# EAGLE design Motherboard (EAGLE 8.0.0)
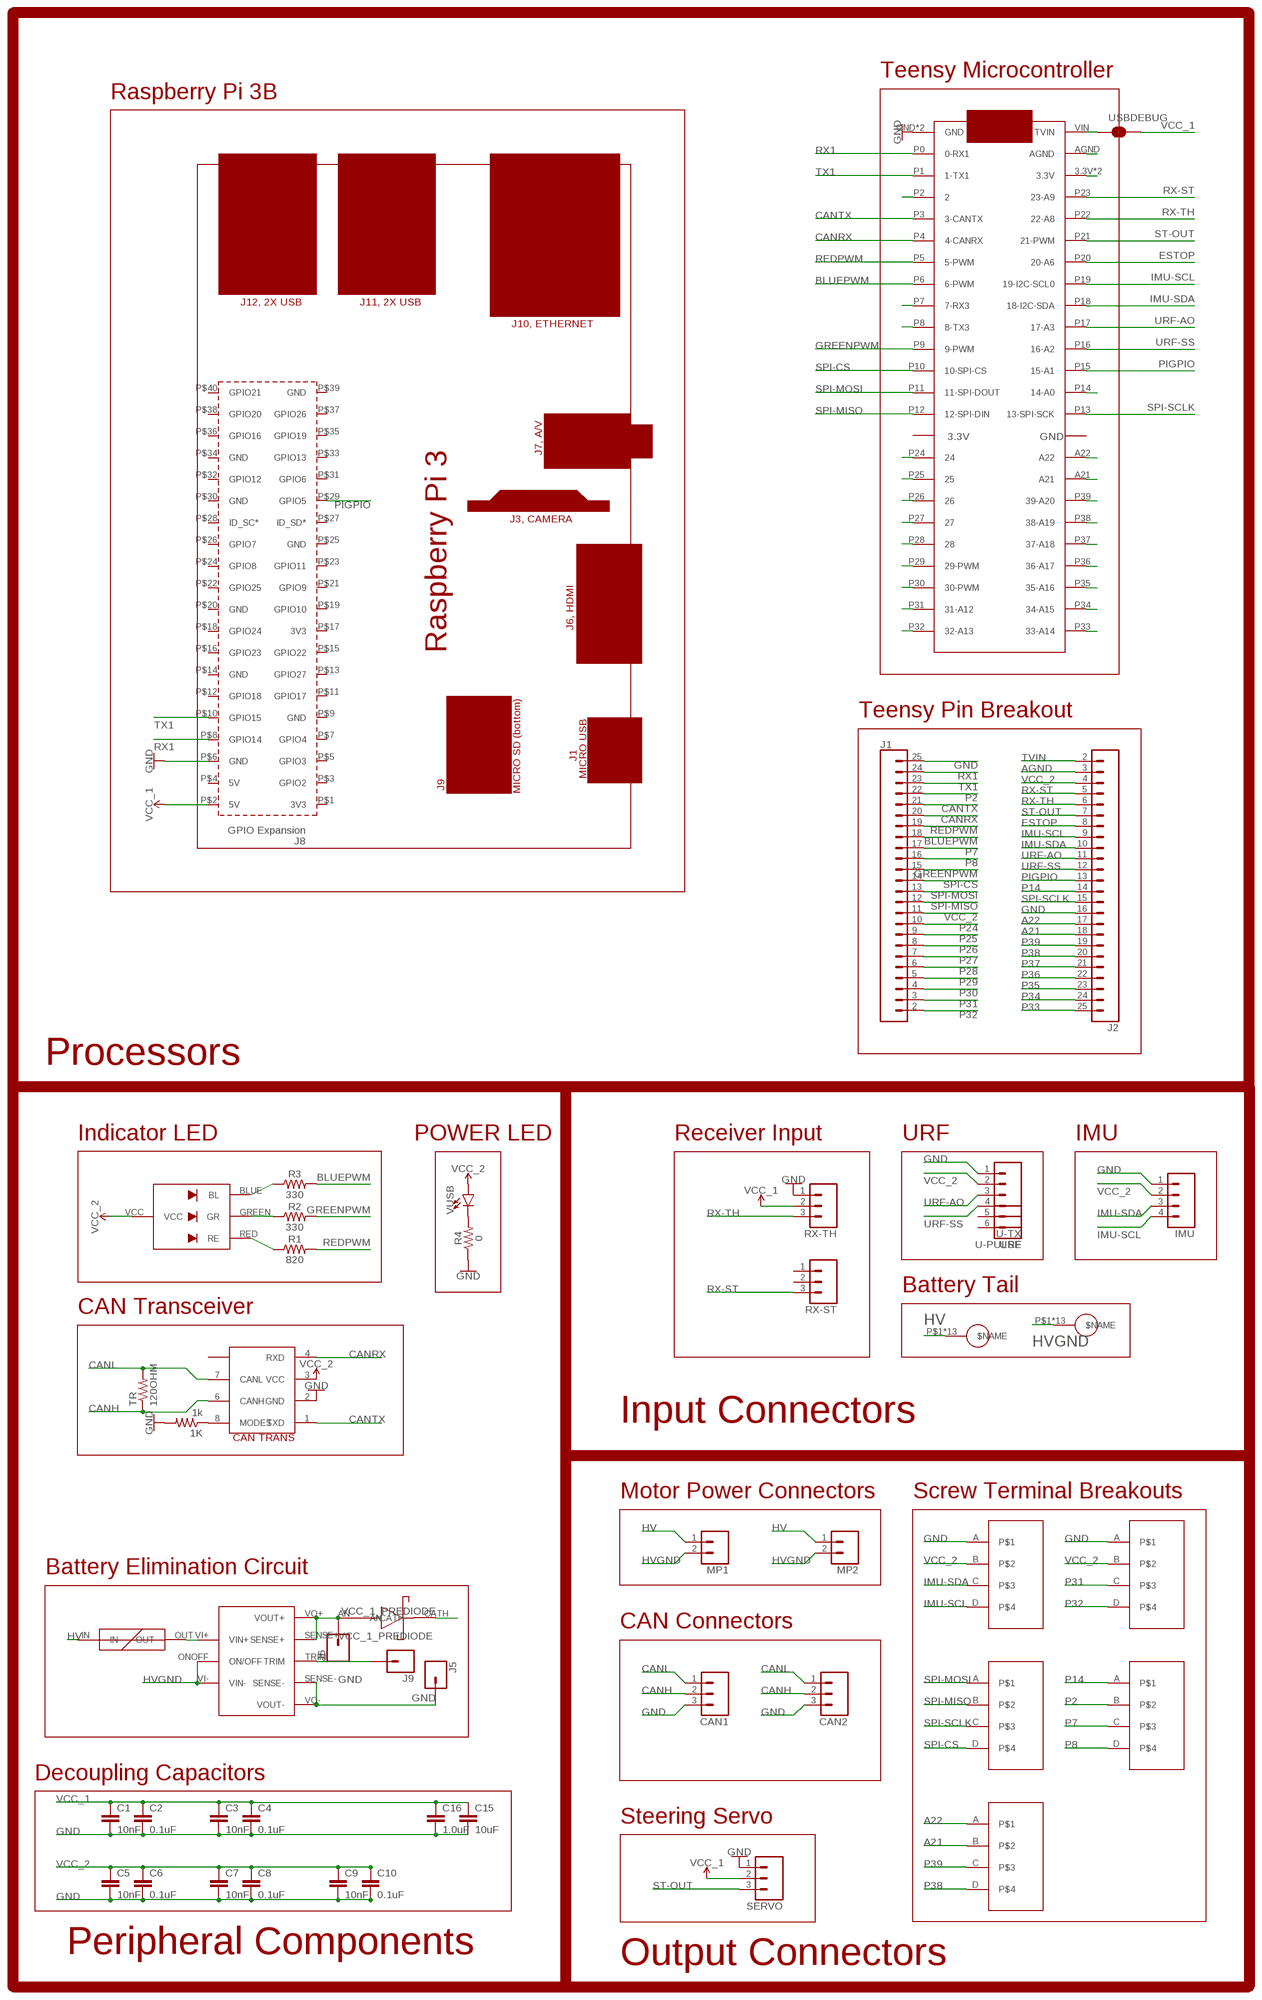
[diagram p0: schematic, sheet 1]

## Parts
1K  1k  R-US_R0603  [R0603]
C1  10nF  10NF-0603-50V-10%  [0603]
C2  0.1uF  0.1UF-0603-25V-(+80/-20%)  [0603]
C3  10nF  10NF-0603-50V-10%  [0603]
C4  0.1uF  0.1UF-0603-25V-(+80/-20%)  [0603]
C5  10nF  10NF-0603-50V-10%  [0603]
C6  0.1uF  0.1UF-0603-25V-(+80/-20%)  [0603]
C7  10nF  10NF-0603-50V-10%  [0603]
C8  0.1uF  0.1UF-0603-25V-(+80/-20%)  [0603]
C9  10nF  10NF-0603-50V-10%  [0603]
C10  0.1uF  0.1UF-0603-25V-(+80/-20%)  [0603]
C15  10uF  10UF-1206-6.3V-20%  [1206]
C16  1.0uF  1.0UF-1206-50V-10%  [1206]
CAN1  CONN_03SCREW  [SCREWTERMINAL-3.5MM-3]
CAN2  CONN_03SCREW  [SCREWTERMINAL-3.5MM-3]
DAC/ADC  SCREWTERM  [SCREWTERM]
HV+  WIREPAD  [WIREPAD]
HV-  WIREPAD  [WIREPAD]
I2C  SCREWTERM  [SCREWTERM]
IMU  CONN_041X04_NO_SILK  [1X04_NO_SILK]
J1  CONN_24  [1X24]
J2  CONN_24  [1X24]
J5  CONN_01PTH_NO_SILK_YES_STOP  [1X01_NO_SILK]
J6  CONN_01PTH_NO_SILK_YES_STOP  [1X01_NO_SILK]
J9  CONN_01PTH_NO_SILK_YES_STOP  [1X01_NO_SILK]
MP1  CONN_023.5MM  [SCREWTERMINAL-3.5MM-2]
MP2  CONN_023.5MM  [SCREWTERMINAL-3.5MM-2]
PCB1  RPI3  [RPI3]
PWM  SCREWTERM  [SCREWTERM]
R1  820  0OHM-0603-1/10W-5%  [0603]
R2  330  0OHM-0603-1/10W-5%  [0603]
R3  330  0OHM-0603-1/10W-5%  [0603]
R4  0  0OHM-0603-1/10W-5%  [0603]
RPI-SPI  SCREWTERM  [SCREWTERM]
RX-ST  CONN_03  [1X03]
RX-TH  CONN_03  [1X03]
SERVO  CONN_03  [1X03]
TEENS  TEENSY3.6  [TEENSY3.6]
TR  120OHM  R-US_R0603  [R0603]
U$1  CREERGB  [CREERGB]
U$2  CAN-TRANS  [SO08]
U$4  BEC  [BEC]
U$5  LITTLEFUSE  [LITTLEFUSE]
U$6  SCHOTTKY  [2114]
U-PULSE  CONN_01PTH_NO_SILK_YES_STOP  [1X01_NO_SILK]
U-TX  CONN_01PTH_NO_SILK_YES_STOP  [1X01_NO_SILK]
UART  SCREWTERM  [SCREWTERM]
URF  CONN_06NO_SILK_FEMALE_PTH  [1X06_NO_SILK]
USBDEBUG  JUMPER-SMT_2_NO_NO-SILK  [SMT-JUMPER_2_NO_NO-SILK]
VUSB  LED0603  [LED-0603]

## Nets
A21: DAC/ADC.B J2.18 TEENS.A21
A22: DAC/ADC.A J2.17 TEENS.A22
AGND: J2.3 TEENS.AGND
BLUEPWM: J1.18 R3.2 TEENS.P6(6-PWM)
CANH: CAN1.2 CAN2.2 TR.1 U$2.6(CANH)
CANL: CAN1.1 CAN2.1 TR.2 U$2.7(CANL)
CANRX: J1.20 TEENS.P4(4-CANRX) U$2.4(RXD)
CANTX: J1.21 TEENS.P3(3-CANTX) U$2.1(TXD)
ESTOP: J2.8 TEENS.P20(20-A6)
FUSEDHV: U$4.VI+(VIN+) U$5.OUT
GND: 1K.2 C1.2 C2.2 C3.2 C4.2 C5.2 C6.2 C7.2 C8.2 C9.2 C10.2 C15.2 C16.2 CAN1.3 CAN2.3 I2C.A IMU.1 J1.25 J2.16 J5.1 PCB1.P$6(GND) R4.1 RX-TH.1 SERVO.1 TEENS.GND TEENS.GND2(GND) U$2.2(GND) U$4.SENSE- U$4.VO-(VOUT-) UART.A URF.1
GREENPWM: J1.15 R2.2 TEENS.P9(9-PWM)
HV: HV+.P$1($NAME) HV+.P$2($NAME) HV+.P$3($NAME) HV+.P$4($NAME) HV+.P$5($NAME) HV+.P$6($NAME) HV+.P$7($NAME) HV+.P$8($NAME) HV+.P$9($NAME) HV+.P$10($NAME) HV+.P$11($NAME) HV+.P$12($NAME) HV+.P$13($NAME) MP1.1 MP2.1 U$5.IN
HVGND: HV-.P$1($NAME) HV-.P$2($NAME) HV-.P$3($NAME) HV-.P$4($NAME) HV-.P$5($NAME) HV-.P$6($NAME) HV-.P$7($NAME) HV-.P$8($NAME) HV-.P$9($NAME) HV-.P$10($NAME) HV-.P$11($NAME) HV-.P$12($NAME) HV-.P$13($NAME) MP1.2 MP2.2 U$4.ONOFF(ON/OFF) U$4.VI-(VIN-)
IMU-SCL: I2C.D IMU.4 J2.9 TEENS.P19(19-I2C-SCL0)
IMU-SDA: I2C.C IMU.3 J2.10 TEENS.P18(18-I2C-SDA)
N$3: U-PULSE.1 URF.6
N$4: U-TX.1 URF.5
N$5: 1K.1 U$2.8(MODES)
N$6: R4.2 VUSB.C
N$7: J9.1 U$4.TRIM
N$46: R1.1 U$1.RED(RE)
N$47: R2.1 U$1.GREEN(GR)
N$48: R3.1 U$1.BLUE(BL)
P2: J1.22 PWM.B TEENS.P2
P7: J1.17 PWM.C TEENS.P7(7-RX3)
P8: J1.16 PWM.D TEENS.P8(8-TX3)
P14: J2.14 PWM.A TEENS.P14(14-A0)
P24: J1.10 TEENS.P24
P25: J1.9 TEENS.P25
P26: J1.8 TEENS.P26
P27: J1.7 TEENS.P27
P28: J1.6 TEENS.P28
P29: J1.5 TEENS.P29(29-PWM)
P30: J1.4 TEENS.P30(30-PWM)
P31: J1.3 TEENS.P31(31-A12) UART.C
P32: J1.2 TEENS.P32(32-A13) UART.D
P33: J2.25 TEENS.P33(33-A14)
P34: J2.24 TEENS.P34(34-A15)
P35: J2.23 TEENS.P35(35-A16)
P36: J2.22 TEENS.P36(36-A17)
P37: J2.21 TEENS.P37(37-A18)
P38: DAC/ADC.D J2.20 TEENS.P38(38-A19)
P39: DAC/ADC.C J2.19 TEENS.P39(39-A20)
PIGPIO: J2.13 PCB1.P$29(GPIO5) TEENS.P15(15-A1)
REDPWM: J1.19 R1.2 TEENS.P5(5-PWM)
RX1: J1.24 PCB1.P$8(GPIO14) TEENS.P0(0-RX1)
RX-ST: J2.5 RX-ST.3 TEENS.P23(23-A9)
RX-TH: J2.6 RX-TH.3 TEENS.P22(22-A8)
SPI-CS: J1.14 RPI-SPI.D TEENS.P10(10-SPI-CS)
SPI-MISO: J1.12 RPI-SPI.B TEENS.P12(12-SPI-DIN)
SPI-MOSI: J1.13 RPI-SPI.A TEENS.P11(11-SPI-DOUT)
SPI-SCLK: J2.15 RPI-SPI.C TEENS.P13(13-SPI-SCK)
ST-OUT: J2.7 SERVO.3 TEENS.P21(21-PWM)
TVIN: J2.2 TEENS.VIN(TVIN) USBDEBUG.1
TX1: J1.23 PCB1.P$10(GPIO15) TEENS.P1(1-TX1)
URF-AO: J2.11 TEENS.P17(17-A3) URF.3
URF-SS: J2.12 TEENS.P16(16-A2) URF.4
VCC_1: C1.1 C2.1 C3.1 C4.1 C15.1 C16.1 PCB1.P$2(5V) RX-TH.2 SERVO.2 U$6.CATH USBDEBUG.2
VCC_1_PREDIODE: J6.1 U$4.SENSE+ U$4.VO+(VOUT+) U$6.AN
VCC_2: C5.1 C6.1 C7.1 C8.1 C9.1 C10.1 I2C.B IMU.2 J1.11 J2.4 TEENS.3.3V TEENS.3.3V2(3.3V) U$1.VCC U$2.3(VCC) UART.B URF.2 VUSB.A
Unconnected: PCB1.P$1(3V3) PCB1.P$3(GPIO2) PCB1.P$4(5V) PCB1.P$5(GPIO3) PCB1.P$7(GPIO4) PCB1.P$9(GND) PCB1.P$11(GPIO17) PCB1.P$12(GPIO18) PCB1.P$13(GPIO27) PCB1.P$14(GND) PCB1.P$15(GPIO22) PCB1.P$16(GPIO23) PCB1.P$17(3V3) PCB1.P$18(GPIO24) PCB1.P$19(GPIO10) PCB1.P$20(GND) PCB1.P$21(GPIO9) PCB1.P$22(GPIO25) PCB1.P$23(GPIO11) PCB1.P$24(GPIO8) PCB1.P$25(GND) PCB1.P$26(GPIO7) PCB1.P$27(ID_SD*) PCB1.P$28(ID_SC*) PCB1.P$30(GND) PCB1.P$31(GPIO6) PCB1.P$32(GPIO12) PCB1.P$33(GPIO13) PCB1.P$34(GND) PCB1.P$35(GPIO19) PCB1.P$36(GPIO16) PCB1.P$37(GPIO26) PCB1.P$38(GPIO20) PCB1.P$39(GND) PCB1.P$40(GPIO21) RX-ST.1 RX-ST.2

## Notes on the sheet
- Teensy Microcontroller
- Raspberry Pi 3B
- Teensy Pin Breakout
- Processors
- Indicator LED | POWER LED | Receiver Input | URF | IMU
- Battery Tail
- CAN Transceiver
- Input Connectors
- Motor Power Connectors | Screw Terminal Breakouts
- Battery Elimination Circuit
- CAN Connectors
- Decoupling Capacitors
- Steering Servo
- Peripheral Components | Output Connectors

## Library data of the parts
1K TR = rcl:R-US_: RESISTOR, American symbol
C1 C3 C5 C7 C9 = SparkFun-Capacitors:10NF: 0.01uF/10nF/10,000pF ceramic capacitors A capacitor is a passive two-terminal electrical component used to store electrical energy temporarily in an electric field. CAP-09321; PROD_ID: CAP-00867
C2 C4 C6 C8 C10 = SparkFun-Capacitors:0.1UF: 0.1µF ceramic capacitors A capacitor is a passive two-terminal electrical component used to store electrical energy temporarily in an electric field.; PROD_ID: CAP-00810
C15 = SparkFun-Capacitors:10UF: 10.0µF ceramic capacitors A capacitor is a passive two-terminal electrical component used to store electrical energy temporarily in an electric field.; PROD_ID: CAP-10057
C16 = SparkFun-Capacitors:1.0UF: 1µF ceramic capacitors A capacitor is a passive two-terminal electrical component used to store electrical energy temporarily in an electric field.; PROD_ID: CAP-09822
CAN1 CAN2 = SparkFun-Connectors:CONN_03: Multi connection point. Often used as Generic Header-pin footprint for 0.1 inch spaced/style header connections On any of the 0.1 inch spaced packages, you can populate with these: Break Away Headers - Straight <https://www.sparkfun.com/products/116> (PRT-00116) Break Away Male Headers - Right Angle <https://www.sparkfun.com/products/553> (PRT-00553) Female Headers <https://www.sparkfun.com/products/115> (PRT-00115) Break Away Headers - Machine Pin <https://www.sparkfun.com/products/117> (PRT-00117) Break Away Female Headers - Swiss Machine Pin <https://www.sparkfun.com/products/743> (PRT-00743) Stackable Header - 3 Pin (Female, 0.1") <https://www.sparkfun.com/products/13875> (PRT-13875) For SCREWTERMINALS and SPRING TERMINALS visit here: Screw Terimnals on SparkFun.com <https://www.sparkfun.com/search/results?term=Screw+Terminals> (5mm/3.5mm/2.54mm spacing) This device is also useful as a general connection point to wire up your design to another part of your project. Our various solder wires solder well into these plated through hole pads. Hook-Up Wire - Assortment (Stranded, 22 AWG) <https://www.sparkfun.com/products/11375> (PRT-11375) Hook-Up Wire - Assortment (Solid Core, 22 AWG) <https://www.sparkfun.com/products/11367> (PRT-11367) View the entire wire category on our website here <https://www.sparkfun.com/categories/141> Special notes: Molex polarized connector foot print use with SKU : PRT-08232 with associated crimp pins and housings.; PROD_ID: CONN-08288; SF_ID: PRT-08235
DAC/ADC I2C PWM RPI-SPI UART = motherboard parts:SCREWTERM
HV+ HV- = motherboard parts:WIREPAD
IMU = SparkFun-Connectors:CONN_04: Multi connection point. Often used as Generic Header-pin footprint for 0.1 inch spaced/style header connections On any of the 0.1 inch spaced packages, you can populate with these: Break Away Headers - Straight <https://www.sparkfun.com/products/116> (PRT-00116) Break Away Male Headers - Right Angle <https://www.sparkfun.com/products/553> (PRT-00553) Female Headers <https://www.sparkfun.com/products/115> (PRT-00115) Break Away Headers - Machine Pin <https://www.sparkfun.com/products/117> (PRT-00117) Break Away Female Headers - Swiss Machine Pin <https://www.sparkfun.com/products/743> (PRT-00743) For SCREWTERMINALS and SPRING TERMINALS visit here: Screw Terimnals on SparkFun.com <https://www.sparkfun.com/search/results?term=Screw+Terminals> (5mm/3.5mm/2.54mm spacing) This device is also useful as a general connection point to wire up your design to another part of your project. Our various solder wires solder well into these plated through hole pads. Hook-Up Wire - Assortment (Stranded, 22 AWG) <https://www.sparkfun.com/products/11375> (PRT-11375) Hook-Up Wire - Assortment (Solid Core, 22 AWG) <https://www.sparkfun.com/products/11367> (PRT-11367) View the entire wire category on our website here <https://www.sparkfun.com/categories/141> Special notes: Molex polarized connector foot print use with SKU : PRT-08231 with associated crimp pins and housings. 1MM SMD Version SKU: PRT-10208; PROD_ID: CONN-09696
J1 J2 = SparkFun-Connectors:CONN_24: Multi connection point. Often used as Generic Header-pin footprint for 0.1 inch spaced/style header connections On any of the 0.1 inch spaced packages, you can populate with these: Break Away Headers - Straight <https://www.sparkfun.com/products/116> (PRT-00116) Break Away Male Headers - Right Angle <https://www.sparkfun.com/products/553> (PRT-00553) Female Headers <https://www.sparkfun.com/products/115> (PRT-00115) Break Away Headers - Machine Pin <https://www.sparkfun.com/products/117> (PRT-00117) Break Away Female Headers - Swiss Machine Pin <https://www.sparkfun.com/products/743> (PRT-00743) For SCREWTERMINALS and SPRING TERMINALS visit here: Screw Terimnals on SparkFun.com <https://www.sparkfun.com/search/results?term=Screw+Terminals> (5mm/3.5mm/2.54mm spacing) This device is also useful as a general connection point to wire up your design to another part of your project. Our various solder wires solder well into these plated through hole pads. Hook-Up Wire - Assortment (Stranded, 22 AWG) <https://www.sparkfun.com/products/11375> (PRT-11375) Hook-Up Wire - Assortment (Solid Core, 22 AWG) <https://www.sparkfun.com/products/11367> (PRT-11367) View the entire wire category on our website here <https://www.sparkfun.com/categories/141> Special notes: Molex polarized connector foot print use with SKU : PRT-08231 with associated crimp pins and housings. 1MM SMD Version SKU: PRT-10208 NOTES ON THE VARIANTS LOCK and LOCK_LONGPADS... This footprint was designed to help hold the alignment of a through-hole component (i.e. 6-pin header) while soldering it into place. You may notice that each hole has been shifted either up or down by 0.005 of an inch from it's more standard position (which is a perfectly straight line). This slight alteration caused the pins (the squares in the middle) to touch the edges of the holes. Because they are alternating, it causes a "brace" to hold the component in place. 0.005 has proven to be the perfect amount of "off-center" position when using our standard breakaway headers. Although looks a little odd when you look at the bare footprint, once you have a header in there, the alteration is very hard to notice. Also,if you push a header all the way into place, it is covered up entirely on the bottom side.
J5 J6 J9 U-PULSE U-TX = SparkFun-Connectors:CONN_01: Single connection point. Often used as Generic Header-pin footprint for 0.1 inch spaced/style header connections On any of the 0.1 inch spaced packages, you can populate with these: Break Away Headers - Straight <https://www.sparkfun.com/products/116> (PRT-00116) Break Away Male Headers - Right Angle <https://www.sparkfun.com/products/553> (PRT-00553) Female Headers <https://www.sparkfun.com/products/115> (PRT-00115) Break Away Headers - Machine Pin <https://www.sparkfun.com/products/117> (PRT-00117) Break Away Female Headers - Swiss Machine Pin <https://www.sparkfun.com/products/743> (PRT-00743) This device is also useful as a general connection point to wire up your design to another part of your project. Our various solder wires solder well into these plated through hole pads. Hook-Up Wire - Assortment (Stranded, 22 AWG) <https://www.sparkfun.com/products/11375> (PRT-11375) Hook-Up Wire - Assortment (Solid Core, 22 AWG) <https://www.sparkfun.com/products/11367> (PRT-11367) View the entire wire category on our website here <https://www.sparkfun.com/categories/141> Special notes: SMTSO-256-ET is a "flush mount" nut for a 4-40 screw. We mostly use this on specialty testbeds; it is a nice way to connect hardware to your PCB at an adjustable hieght. Also note, the SNAP packages are for using a snappable style connector. We sell a baggie of snaps and they are also used on two LilyPad designs: Snap Assortment - 30 pack (male and female) <https://www.sparkfun.com/products/11347> (DEV-11347) LilyPad Arduino SimpleSnap <https://www.sparkfun.com/products/10941> (DEV-10941) LilyPad SimpleSnap Protoboard <https://www.sparkfun.com/products/10940> (DEV-10940)
MP1 MP2 = SparkFun-Connectors:CONN_02: Multi connection point. Often used as Generic Header-pin footprint for 0.1 inch spaced/style header connections On any of the 0.1 inch spaced packages, you can populate with these: Break Away Headers - Straight <https://www.sparkfun.com/products/116> (PRT-00116) Break Away Male Headers - Right Angle <https://www.sparkfun.com/products/553> (PRT-00553) Female Headers <https://www.sparkfun.com/products/115> (PRT-00115) Break Away Headers - Machine Pin <https://www.sparkfun.com/products/117> (PRT-00117) Break Away Female Headers - Swiss Machine Pin <https://www.sparkfun.com/products/743> (PRT-00743) For SCREWTERMINALS and SPRING TERMINALS visit here: Screw Terimnals on SparkFun.com <https://www.sparkfun.com/search/results?term=Screw+Terminals> (5mm/3.5mm/2.54mm spacing) This device is also useful as a general connection point to wire up your design to another part of your project. Our various solder wires solder well into these plated through hole pads. Hook-Up Wire - Assortment (Stranded, 22 AWG) <https://www.sparkfun.com/products/11375> (PRT-11375) Hook-Up Wire - Assortment (Solid Core, 22 AWG) <https://www.sparkfun.com/products/11367> (PRT-11367) View the entire wire category on our website here <https://www.sparkfun.com/categories/141> Special notes: Molex polarized connector foot print use with: PRT-08233 with associated crimp pins and housings. 2.54_SCREWTERM for use with PRT-10571. 3.5mm Screw Terminal footprints for PRT-08084 5mm Screw Terminal footprints for use with PRT-08432; PROD_ID: CONN-08399
PCB1 = e14_Rpi3_RevA:RPI3: Device for Raspberry Pi 3 board created by Dave Young for www.element14.com More information and support community is available at https://www.element14.com/community/community/raspberry-pi
R1-R3 = SparkFun-Resistors:0OHM: 0Ω resistor A resistor is a passive two-terminal electrical component that implements electrical resistance as a circuit element. Resistors act to reduce current flow, and, at the same time, act to lower voltage levels within circuits. - Wikipedia; PROD_ID: RES-08609; VALUE: 0
R4 = SparkFun-Resistors:0OHM: 0Ω resistor A resistor is a passive two-terminal electrical component that implements electrical resistance as a circuit element. Resistors act to reduce current flow, and, at the same time, act to lower voltage levels within circuits. - Wikipedia; PROD_ID: RES-08609
RX-ST RX-TH SERVO = SparkFun-Connectors:CONN_03: Multi connection point. Often used as Generic Header-pin footprint for 0.1 inch spaced/style header connections On any of the 0.1 inch spaced packages, you can populate with these: Break Away Headers - Straight <https://www.sparkfun.com/products/116> (PRT-00116) Break Away Male Headers - Right Angle <https://www.sparkfun.com/products/553> (PRT-00553) Female Headers <https://www.sparkfun.com/products/115> (PRT-00115) Break Away Headers - Machine Pin <https://www.sparkfun.com/products/117> (PRT-00117) Break Away Female Headers - Swiss Machine Pin <https://www.sparkfun.com/products/743> (PRT-00743) Stackable Header - 3 Pin (Female, 0.1") <https://www.sparkfun.com/products/13875> (PRT-13875) For SCREWTERMINALS and SPRING TERMINALS visit here: Screw Terimnals on SparkFun.com <https://www.sparkfun.com/search/results?term=Screw+Terminals> (5mm/3.5mm/2.54mm spacing) This device is also useful as a general connection point to wire up your design to another part of your project. Our various solder wires solder well into these plated through hole pads. Hook-Up Wire - Assortment (Stranded, 22 AWG) <https://www.sparkfun.com/products/11375> (PRT-11375) Hook-Up Wire - Assortment (Solid Core, 22 AWG) <https://www.sparkfun.com/products/11367> (PRT-11367) View the entire wire category on our website here <https://www.sparkfun.com/categories/141> Special notes: Molex polarized connector foot print use with SKU : PRT-08232 with associated crimp pins and housings.
TEENS = motherboard parts:TEENSY3.6
U$1 = motherboard parts:CREERGB
U$2 = motherboard parts:CAN-TRANS: TI SN65HVD232DR 3.3V Can Bus Transceiver
U$4 = motherboard parts:BEC
U$5 = motherboard parts:LITTLEFUSE
U$6 = motherboard parts:SCHOTTKY: SD2114S040S8R0
URF = SparkFun-Connectors:CONN_06: Multi connection point. Often used as Generic Header-pin footprint for 0.1 inch spaced/style header connections On any of the 0.1 inch spaced packages, you can populate with these: Break Away Headers - Straight <https://www.sparkfun.com/products/116> (PRT-00116) Break Away Male Headers - Right Angle <https://www.sparkfun.com/products/553> (PRT-00553) Female Headers <https://www.sparkfun.com/products/115> (PRT-00115) Break Away Headers - Machine Pin <https://www.sparkfun.com/products/117> (PRT-00117) Break Away Female Headers - Swiss Machine Pin <https://www.sparkfun.com/products/743> (PRT-00743) Arduino Stackable Header - 6 Pin <https://www.sparkfun.com/products/9280> (PRT-09280) For SCREWTERMINALS and SPRING TERMINALS visit here: Screw Terimnals on SparkFun.com <https://www.sparkfun.com/search/results?term=Screw+Terminals> (5mm/3.5mm/2.54mm spacing) This device is also useful as a general connection point to wire up your design to another part of your project. Our various solder wires solder well into these plated through hole pads. Hook-Up Wire - Assortment (Stranded, 22 AWG) <https://www.sparkfun.com/products/11375> (PRT-11375) Hook-Up Wire - Assortment (Solid Core, 22 AWG) <https://www.sparkfun.com/products/11367> (PRT-11367) View the entire wire category on our website here <https://www.sparkfun.com/categories/141>; PROD_ID: CONN-08437
USBDEBUG = SparkFun-Jumpers:JUMPER-SMT_2_NO: Normally open jumper This jumper has two pads in close proximity to each other. Apply solder to close the connection. Round pads are easier to solder for beginners, but are a lot larger. SparkFun Product that uses the round pads: SparkFun EL Sequencer <https://www.sparkfun.com/products/12781>
VUSB = SparkFun-LED:LED: LED (Generic) Standard schematic elements and footprints for 5mm, 3mm, 1206, and 0603 sized LEDs. Generic LEDs with no color specified.

## Board
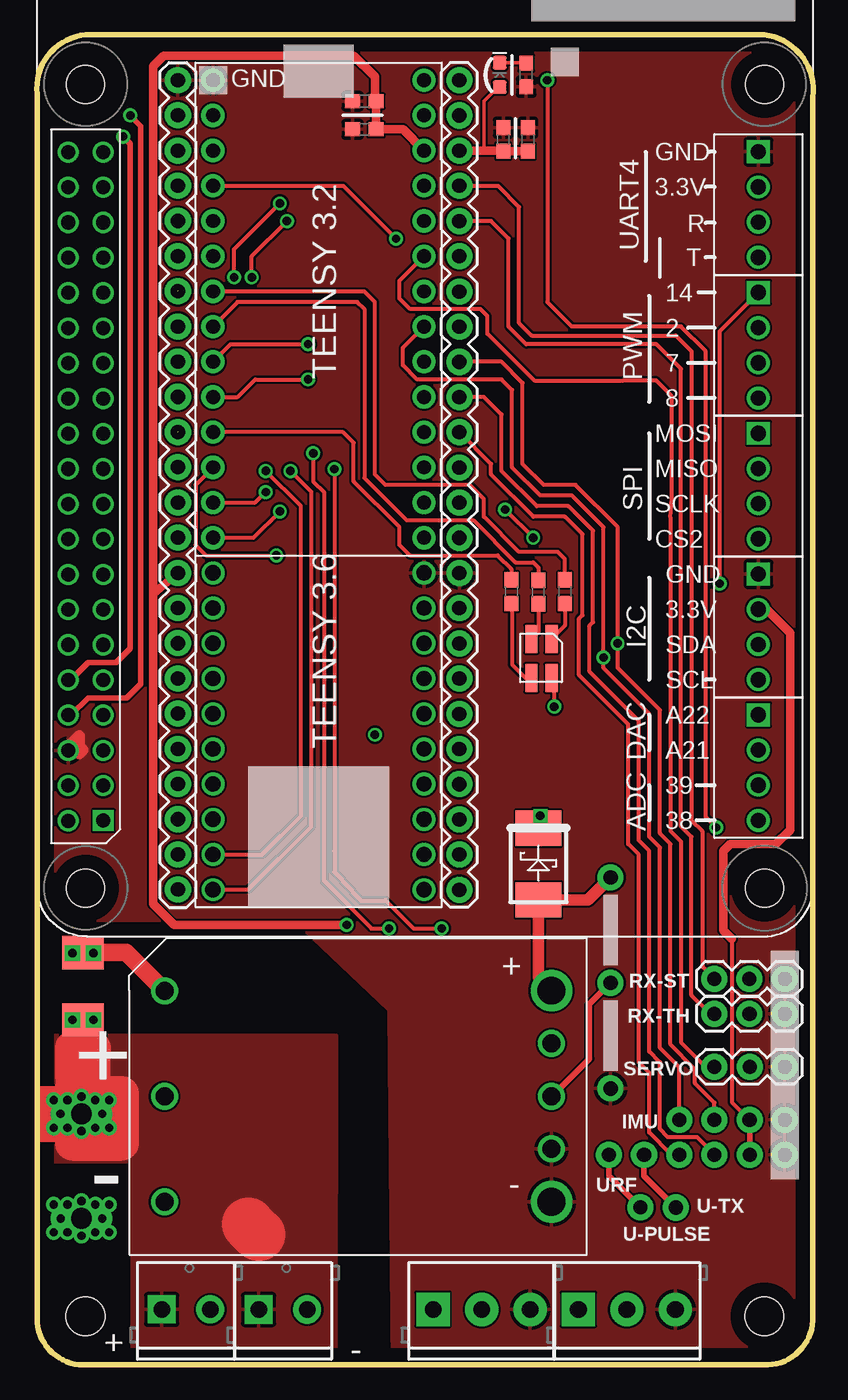
[diagram p1: board, top side]
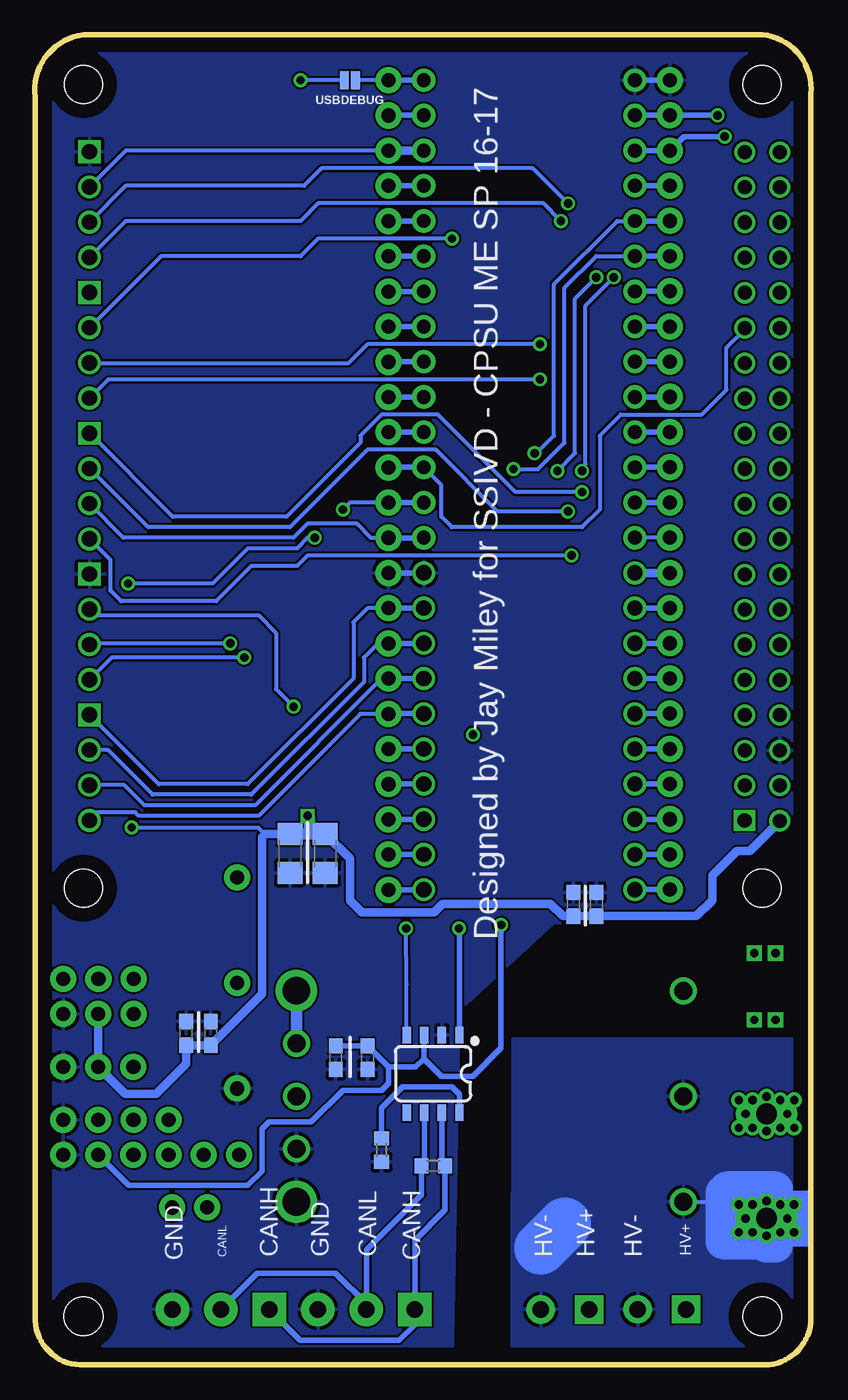
[diagram p2: board, bottom side, seen from below]

Size 56.05 x 96 mm. Coordinates in mm from the lower left corner, seen from the top.
Outline: 0.02,3.35 arc90 3.37,0 52.77,0 arc90 56.02,3.5 56.02,91.5 arc90 52.52,96 3.52,96 arc90 0.02,91.75 0.02,3.35
Copper layers (1*16): Top 0.035mm / dielectric 1.5mm / Bottom 0.035mm
Design rules "default *": minimum track width 10mil, minimum drill 10mil, track to track 6mil, track to pad 6mil, pad to pad 6mil, via to via 6mil, smd to smd 6mil, copper to edge 40mil, drill to drill 8mil, minimum pad ring 10mil, minimum via ring 8mil, stop-mask expansion 4mil, vias tented up to drill 0mil, thermal gap 10mil
Holes 2.8 mm at 52.52,3.5 3.52,3.5

### Footprints (pad centres in the part's own frame; a part is rotated, then mirrored left to right if it is on the bottom)
R0603 = smd 1 x 1.1: 1 -0.85,0; 2 0.85,0
0603 = smd 1.1 x 1: 1 -0.85,0; 2 0.85,0
1206 = smd 1.6 x 1.8: 1 -1.4,0; 2 1.4,0
SCREWTERMINAL-3.5MM-3 = drill 1.2 pad 2.413 square: 1 0,0 | drill 1.2 pad 2.413: 2 3.5,0; 3 7,0
SCREWTERM = drill 1.1 square: A 0,0 | drill 1.1: B 2.54,0; C 5.08,0; D 7.62,0
WIREPAD = drill 1.5 long: P$1 2,3 | drill 0.6: P$2 3,2; P$3 1,2; P$4 2,1.5; P$5 3,1; P$6 1,1; P$7 2,4.5; P$8 3,4; P$9 1,4; P$10 1,5; P$11 3,5; P$12 0.75,3; P$13 3.25,3
1X04_NO_SILK = drill 1.016 pad 1.88: 1 0,0; 2 2.54,0; 3 5.08,0; 4 7.62,0
1X24 = drill 1.016 pad 1.88: 2 -26.67,0; 3 -24.13,0; 4 -21.59,0; 5 -19.05,0; 6 -16.51,0; 7 -13.97,0; 8 -11.43,0; 9 -8.89,0; 10 -6.35,0; 11 -3.81,0; 12 -1.27,0; 13 1.27,0; 14 3.81,0; 15 6.35,0; 16 8.89,0; 17 11.43,0; 18 13.97,0; 19 16.51,0; 20 19.05,0; 21 21.59,0; 22 24.13,0; 23 26.67,0; 24 29.21,0; 25 31.75,0
1X01_NO_SILK = drill 1.016 pad 1.88: 1 0,0
SCREWTERMINAL-3.5MM-2 = drill 1.2 pad 2.032 square: 1 0,0 | drill 1.2 pad 2.032: 2 3.5,0
RPI3 = drill 1.016 square: P$1 8.37,51.23 | drill 1.016: P$2 8.357,53.772; P$3 10.897,51.232; P$4 10.897,53.772; P$5 13.437,51.232; P$6 13.437,53.772; P$7 15.977,51.232; P$8 15.977,53.772; P$9 18.517,51.232; P$10 18.517,53.772; P$11 21.057,51.232; P$12 21.057,53.772; P$13 23.597,51.232; P$14 23.597,53.772; P$15 26.137,51.232; P$16 26.137,53.772; P$17 28.677,51.232; P$18 28.677,53.772; P$19 31.217,51.232; P$20 31.217,53.772; P$21 33.757,51.232; P$22 33.757,53.772; P$23 36.297,51.232; P$24 36.297,53.772; P$25 38.837,51.232; P$26 38.837,53.772; P$27 41.377,51.232; P$28 41.377,53.772; P$29 43.917,51.232; P$30 43.917,53.772; P$31 46.457,51.232; P$32 46.457,53.772; P$33 48.997,51.232; P$34 48.997,53.772; P$35 51.537,51.232; P$36 51.537,53.772; P$37 54.077,51.232; P$38 54.077,53.772; P$39 56.617,51.232; P$40 56.617,53.772 | hole 2.75: 3.5,3.5; 61.5,3.5; 3.5,52.5; 61.5,52.5
1X03 = drill 1.016 pad 1.88: 1 0,0; 2 2.54,0; 3 5.08,0
TEENSY3.6 = drill 1 pad 1.676: 3.3V 15.24,-5.08; AGND 15.24,-2.54; GND 0,0; P0 0,-2.54; P1 0,-5.08; P2 0,-7.62; P3 0,-10.16; P4 0,-12.7; P5 0,-15.24; P6 0,-17.78; P7 0,-20.32; P8 0,-22.86; P9 0,-25.4; P10 0,-27.94; P11 0,-30.48; P12 0,-33.02; P13 15.24,-33.02; P14 15.24,-30.48; P15 15.24,-27.94; P16 15.24,-25.4; P17 15.24,-22.86; P18 15.24,-20.32; P19 15.24,-17.78; P20 15.24,-15.24; P21 15.24,-12.7; P22 15.24,-10.16; P23 15.24,-7.62; VIN 15.24,0 | drill 1.1: 3.3V2 0,-35.56; A21 15.24,-40.64; A22 15.24,-38.1; GND2 15.24,-35.56; P24 0,-38.1; P25 0,-40.64; P26 0,-43.18; P27 0,-45.72; P28 0,-48.26; P29 0,-50.8; P30 0,-53.34; P31 0,-55.88; P32 0,-58.42; P33 15.24,-58.42; P34 15.24,-55.88; P35 15.24,-53.34; P36 15.24,-50.8; P37 15.24,-48.26; P38 15.24,-45.72; P39 15.24,-43.18
CREERGB = smd 2 x 0.9: BLUE 2.8,0; GREEN 0,0; RED 2.8,-1.45; VCC 0,-1.45
SO08 = smd 0.6 x 1.2: 1 -1.905,-2.8; 2 -0.635,-2.8; 3 0.635,-2.8; 4 1.905,-2.8; 5 1.905,2.8; 6 0.635,2.8; 7 -0.635,2.8; 8 -1.905,2.8
BEC = drill 1.3: ONOFF 2.54,-11.43; SENSE+ 30.48,-7.62; SENSE- 30.48,-15.24; TRIM 30.48,-11.43; VI+ 2.54,-3.81; VI- 2.54,-19.05 | drill 2: VO+ 30.48,-3.81; VO- 30.48,-19.05
LITTLEFUSE = smd 2.4 x 3: IN 0,0; OUT 4.86,0 | drill 0.6 square: P$1 0,-0.762; P$2 0,0.762; P$3 4.826,-0.762; P$4 4.826,0.762
2114 = smd 2.54 x 3.302: AN 3.912,0; CATH -1.27,0
1X06_NO_SILK = drill 1.016 pad 1.88: 1 0,0; 2 2.54,0; 3 5.08,0; 4 7.62,0; 5 10.16,0; 6 12.7,0
SMT-JUMPER_2_NO_NO-SILK = smd 0.635 x 1.27: 1 -0.406,0; 2 0.406,0
LED-0603 = smd 1 x 1: A -0.877,0; C 0.877,0

### Placement (x,y rotation side)
1K  31.01,15.49 270 bottom
C1  43.32,23.92 90 bottom
C2  45.1,23.92 90 bottom
C3  15.5,33.24 90 bottom
C4  17.15,33.24 90 bottom
C5  23.64,91.19 180 top
C6  23.64,89.16 180 top
C7  34.31,22.18 270 bottom
C8  32.02,22.18 270 bottom
C9  33.67,88.44 90 top
C10  35.45,88.44 90 top
C15  37.61,36.91 270 bottom
C16  35.07,36.91 270 bottom
CAN1  39.1,4 0 top
CAN2  28.6,4 0 top
DAC/ADC  52.09,46.91 270 top
HV+  0.22,20.11 270 top
HV-  0.22,8.57 90 bottom
I2C  52.09,57.07 270 top
IMU  53.99,17.69 180 top
J1  10.18,60.97 90 top
J2  30.5,66.04 270 top
J5  41.42,19.94 0 top
J6  41.42,35.18 0 top
J9  41.42,27.56 0 top
MP1  16.02,4 0 top
MP2  9.02,4 0 top
PCB1  56.03,30.91 90 top
PWM  52.09,77.39 270 top
R1  38.12,55.8 90 top
R2  34.26,55.8 90 top
R3  36.21,55.78 90 top
R4  35.32,93.09 90 top
RPI-SPI  52.09,67.23 270 top
RX-ST  53.98,27.85 180 top
RX-TH  53.99,25.33 180 top
SERVO  54,21.52 180 top
TEENS  12.72,92.71 0 top
TR  27.28,14.36 0 bottom
U$1  35.7,49.58 90 top
U$2  27.29,21 180 bottom
U$4  6.67,30.81 0 top
U$5  3.34,24.89 90 top
U$6  36.21,37.47 270 top
U-PULSE  43.58,11.36 0 top
U-TX  46.12,11.35 0 top
UART  52.09,87.55 270 top
URF  54,15.16 180 top
USBDEBUG  33.29,92.71 180 bottom
VUSB  33.42,93.09 90 top

### Tracks (layer width: path | path; a pad name or v marks a point on that pad's centre or on a via)
A21
  Bottom 0.305: J2.18 31.26,52.07 32.28,51.05 32.28,49.28 40.4,41.15 47.54,41.15 50.75,44.36 52.08,44.36 DAC/ADC.B
  Bottom 0.406: TEENS.A21 J2.18
A22
  Bottom 0.305: J2.17 32.03,54.61 33.04,53.59 33.04,49.53 40.66,41.91 47.09,41.91 DAC/ADC.A
  Bottom 0.406: TEENS.A22 J2.17
AGND
  Bottom 0.406: TEENS.AGND J2.3
BLUEPWM
  Top 0.305: 36.21,57.53 35.83,57.91 34.56,57.91 31.51,60.96 26.69,60.96 23.64,64.01 23.64,76.2 23.13,76.71 14.49,76.71 TEENS.P6 | 36.21,57.53 36.2,57.53 | 36.21,57.53 R3.2
  Bottom 0.406: TEENS.P6 J1.18
CANH
  Bottom 0.406: U$2.6 27.92,14.57 TR.1 28.11,14.34 28.11,12.28 32.1,8.29 CAN2.2 32.1,4.4 34.31,6.6 39.99,6.6 CAN1.2
CANL
  Bottom 0.406: U$2.7 26.65,14.58 TR.2 26.43,11.18 28.6,9.01 CAN2.1 28.6,2.91 29.74,1.78 36.88,1.78 CAN1.1
CANRX  (via drill 0.6)
  Top 0.305: v21.48,64.64 21.48,37.08 21.48,35.56 23.39,33.53 25.16,33.53 27.2,31.5 v29.23,31.5
  Bottom 0.305: TEENS.P4 15.51,80.01 17.8,77.72 17.8,66.55 19.7,64.64 v21.48,64.64 | U$2.4 29.19,27.47 v29.23,31.5
  Bottom 0.406: TEENS.P4 J1.20
CANTX  (via drill 0.6)
  Top 0.305: v19.96,65.79 19.96,63.75 20.72,62.99 20.72,34.92 24.15,31.5 v25.42,31.5
  Bottom 0.305: TEENS.P3 13.98,82.55 18.56,77.98 18.56,67.06 19.83,65.79 v19.96,65.79 | 25.42,23.84 U$2.1
  Bottom 0.406: TEENS.P3 J1.21 | U$2.1 25.38,31.46 v25.42,31.5
ESTOP
  Bottom 0.406: J2.8 TEENS.P20
FUSEDHV
  Top 0.406: 6.47,29.75 6.88,29.75
  Top 1.27: U$5.OUT 6.47,29.75 U$4.VI+
GND
  Top 0.813: PCB1.P$6 2.26,44.58 3.07,45.39 3.07,44.62 3.32,44.37 3.07,44.12
  Bottom 0.406: TEENS.GND J1.25 | TEENS.GND2 J2.16
  pour Top: 0.02,32.06 18.56,32.06 25.42,25.57 25.67,-0.25 55.9,0 55.9,91.36 55.39,96.44 0.02,96.44
  pour Bottom: 0.27,31.94 18.56,31.94 25.42,25.57 25.93,0 55.9,0 55.9,91.36 55.39,96.44 0.02,96.44
GREENPWM  (1 unrouted)
  Top 0.305: TEENS.P9 22.12,67.31 22.88,66.55 22.88,63.75 26.18,60.45 26.18,59.18 26.94,58.42 33.26,58.42 34.25,57.43 34.25,56.66 R2.2 34.31,56.65 34.31,56.9
  Bottom 0.406: TEENS.P9 J1.15
HV
  Top 1.93: 3.22,23.11 2.56,23.11 2.56,22.86
  Top 2.184: U$5.IN 3.22,23.11 HV+.P$1
  Top 2.54: 2.56,18.11 2.56,20.07 | HV+.P$1 2.56,18.11 | 2.56,18.11 2.56,16 6.11,16 6.11,19.56 4.34,19.56 4.34,19.81 4.08,19.81 4.08,22.86 | 3.22,20.83 2.56,20.83 2.56,22.86
  Top 3.81: 16.02,9.4 15.26,10.16
  pour Top: 0.02,23.8 21.62,23.8 21.62,12.37 21.61,12.37 21.61,0 6.88,0 6.88,14.65 0.02,14.65
HVGND
  Bottom 0.305: U$4.VI- 7.46,11.76 7.13,11.43 7.13,11.68 6.37,12.45
  Bottom 2.54: HV-.P$1 2.56,10.57 2.56,12.7 6.11,12.7 6.11,12.45 6.37,12.45 6.37,8.89 2.56,8.89 2.56,8.64 3.22,8.64 HV-.P$1
  Bottom 3.81: 19.52,8.44 17.8,10.16
  pour Bottom: 0.02,23.54 21.52,23.54 21.52,12.37 21.61,12.37 21.61,0 0.02,0.25
IMU-SCL  (via drill 0.6)
  Top 0.305: IMU.4 46.37,21.46 44.98,22.86 44.98,37.34 44.21,38.1 44.21,46.99 40.91,50.29 v40.91,51.05 40.91,60.45 38.63,62.74 36.34,62.74 34.31,64.77 34.31,70.36 33.55,71.12 27.45,71.12 26.43,72.14 26.43,73.41 TEENS.P19
  Bottom 0.305: v40.91,51.05 50.48,51.05 I2C.D
  Bottom 0.406: TEENS.P19 J2.9
IMU-SDA  (via drill 0.6)
  Top 0.305: IMU.3 48.91,18.92 47.52,20.32 47.52,21.34 45.74,23.11 45.74,37.59 44.98,38.35 44.98,47.24 41.93,50.29 v41.93,52.07 41.93,60.45 38.88,63.5 36.59,63.5 35.07,65.02 35.07,70.87 33.55,72.39 J2.10
  Bottom 0.305: v41.93,52.07 52.01,52.07 I2C.C
  Bottom 0.406: TEENS.P18 J2.10
N$1  (via drill 0.6)
  other vias: 24.41,45.47
N$3
  Top 0.406: URF.6 41.3,13.64 U-PULSE.1
N$4
  Top 0.406: URF.5 43.84,13.63 U-TX.1
N$5
  Bottom 0.406: 1K.1 31.01,18.54 29.48,20.07 25.93,20.07 25.38,19.52 U$2.8
N$6
  Top 0.254: VUSB.C 35.3,93.97 R4.2
N$7
  Top 0.406: U$4.TRIM 37.18,19.38 39.9,22.1 39.9,26.04 J9.1
N$46
  Top 0.305: R1.1 38.12,53.34 U$1.RED
N$47
  Top 0.305: R2.1 34.31,54.9 34.31,50.55 35.28,49.58 U$1.GREEN
N$48
  Top 0.305: R3.1 36.2,52.88 U$1.BLUE
P2  (via drill 0.6)
  Top 0.305: TEENS.P2 22.11,85.09 v25.93,81.28
  Bottom 0.305: v25.93,81.28 35.58,81.28 36.85,80.01 46.93,80.01 PWM.B
  Bottom 0.406: TEENS.P2 J1.22
P7  (via drill 0.6)
  Top 0.305: TEENS.P7 13.99,73.66 v19.58,73.66
  Bottom 0.305: PWM.C 33.37,72.31 32.02,73.66 v19.58,73.66
  Bottom 0.406: TEENS.P7 J1.17
P8  (via drill 0.6)
  Top 0.305: TEENS.P8 14.5,69.85 15.77,71.12 v19.58,71.12
  Bottom 0.305: v19.58,71.12 50.74,71.12 PWM.D
  Bottom 0.406: TEENS.P8 J1.16
P14  (via drill 0.6)
  Top 0.305: v33.8,61.72 v35.83,59.69 | v49.29,56.39 49.29,74.6 PWM.A
  Bottom 0.305: J2.14 33.3,62.23 v33.8,61.72 | v35.83,59.69 36.34,59.69 37.1,58.93 40.66,58.93 43.2,56.39 v49.29,56.39
  Bottom 0.406: TEENS.P14 J2.14
P24
  Bottom 0.406: J1.10 TEENS.P24
P25
  Bottom 0.406: TEENS.P25 J1.9
P26
  Bottom 0.406: J1.8 TEENS.P26
P27
  Bottom 0.406: TEENS.P27 J1.7
P28
  Bottom 0.406: TEENS.P28 J1.6
P29
  Bottom 0.406: TEENS.P29 J1.5
P30
  Bottom 0.406: TEENS.P30 J1.4
P31  (via drill 0.6)
  Top 0.305: TEENS.P31 16.28,36.83 19.07,39.62 19.07,61.98 v16.53,64.52 | v14.24,78.49 14.24,80.52 v17.54,83.82
  Bottom 0.305: v16.53,64.52 16.53,64.77 16.27,65.02 16.27,76.45 v14.24,78.49 | v17.54,83.82 20.08,86.36 35.32,86.36 36.59,85.09 49.47,85.09 UART.C
  Bottom 0.406: TEENS.P31 J1.3
P32  (via drill 0.6)
  Top 0.305: TEENS.P32 15.26,34.29 19.83,38.86 19.83,62.99 v18.31,64.52 | v15.51,78.49 15.51,80.01 v18.05,82.55
  Bottom 0.305: v18.31,64.52 17.04,65.79 17.04,76.96 v15.51,78.49 | v18.05,82.55 19.32,83.82 35.58,83.82 36.85,82.55 49.47,82.55 UART.D
  Bottom 0.406: TEENS.P32 J1.2
P33
  Bottom 0.406: J2.25 TEENS.P33
P34
  Bottom 0.406: TEENS.P34 J2.24
P35
  Bottom 0.406: J2.23 TEENS.P35
P36
  Bottom 0.406: TEENS.P36 J2.22
P37
  Bottom 0.406: TEENS.P37 J2.21
P38
  Bottom 0.305: J2.20 32.53,46.99 39.9,39.62 48.53,39.62 48.79,39.88 51.5,39.88 DAC/ADC.D
  Bottom 0.406: TEENS.P38 J2.20
P39
  Bottom 0.305: J2.19 31.01,49.53 40.15,40.39 48.12,40.39 49.57,41.84 DAC/ADC.C
  Bottom 0.406: TEENS.P39 J2.19
PIGPIO
  Bottom 0.305: TEENS.P15 26.69,63.51 26.69,61.21 25.93,60.45 16.53,60.45 15.26,61.72 15.26,67.06 13.73,68.58 7.89,68.58 6.11,70.36 6.11,73.41 4.8,74.72 PCB1.P$29
  Bottom 0.406: TEENS.P15 J2.13
REDPWM  (1 unrouted)
  Top 0.305: R1.2 38.12,58.17 37.61,58.67 34.82,58.67 32.28,61.21 32.28,62.48 31.26,63.5 25.16,63.5 24.4,64.26 24.4,76.71 23.64,77.47 TEENS.P5
  Bottom 0.406: TEENS.P5 J1.19
RX1  (via drill 0.6)
  Top 0.406: PCB1.P$8 2.45,46.89 3.7,48.13 6.49,48.13 7.51,49.15 7.51,89.41 v6.75,90.17
  Bottom 0.406: TEENS.P0 J1.24 10.17,90.17 v6.75,90.17
RX-ST
  Top 0.305: RX-ST.3 48.02,28.75 48.02,38.53 47.26,39.29 47.26,73.15 46.12,74.29 35.71,74.29 34.82,75.18 34.82,83.57 33.3,85.09 J2.5
  Bottom 0.406: TEENS.P23 J2.5
RX-TH
  Top 0.305: RX-TH.3 48.61,25.32 47.26,26.67 47.26,38.1 46.5,38.86 46.5,71.88 44.72,73.66 35.32,73.66 35.2,73.79 | 35.2,73.79 35.34,73.64 | 35.2,73.79 34.05,74.93 34.05,81.28 32.78,82.55 J2.6
  Bottom 0.406: J2.6 TEENS.P22
SPI-CS  (via drill 0.6)
  Top 0.305: TEENS.P10 11.45,63.5 11.45,59.18 12.21,58.42 v17.29,58.42
  Bottom 0.305: v17.29,58.42 36.34,58.42 37.1,57.66 40.4,57.66 42.94,55.12 49.8,55.12 50.56,55.88 50.56,58.09 RPI-SPI.D
  Bottom 0.406: TEENS.P10 J1.14
SPI-MISO  (via drill 0.6)
  Top 0.305: TEENS.P12 15.64,59.69 v17.54,61.59
  Bottom 0.305: TEENS.P12 J1.12 | v17.54,61.59 22.62,61.59 27.07,66.04 32.02,66.04 37.61,60.45 47.85,60.45 RPI-SPI.B
SPI-MOSI  (via drill 0.6)
  Top 0.305: TEENS.P11 15.77,62.23 v16.53,62.99
  Bottom 0.305: 10.14,62.2 J1.13 10.07,62.13 | v16.53,62.99 21.35,62.99 26.94,68.58 31.01,68.58 32.53,67.06 32.53,66.55 37.86,61.21 46.07,61.21 RPI-SPI.A
  Bottom 0.406: TEENS.P11 J1.13
SPI-SCLK
  Bottom 0.305: RPI-SPI.C 49.62,59.69 37.36,59.69 36.34,60.71 32.78,60.71 31.76,59.69 J2.15
  Bottom 0.406: J2.15 TEENS.P13
ST-OUT
  Top 0.305: TEENS.P21 26.18,78.24 26.18,76.96 26.94,76.2 32.02,76.2 32.53,75.69 32.53,74.42 35.91,71.04 42.35,71.04 42.36,71.05 44.68,71.05 45.82,69.91 45.82,69.09 45.82,68.83 45.82,62.57 45.74,61.13 45.74,38.53 46.5,37.77 46.5,23.29 48.27,21.52 SERVO.3
  Bottom 0.406: TEENS.P21 J2.7
TVIN
  Bottom 0.305: J2.2 USBDEBUG.1
  Bottom 0.406: TEENS.VIN J2.2
TX1  (via drill 0.6)
  Top 0.406: PCB1.P$10 2.45,49.43 3.7,50.67 5.73,50.67 6.75,51.69 6.75,88.14 v6.24,88.65
  Bottom 0.406: TEENS.P1 J1.23 9.18,88.65 v6.24,88.65
URF-AO
  Top 0.305: URF.3 48.92,15.2 47.67,16.43 45.54,16.43 44.98,17.02 44.98,21.84 44.21,22.61 44.21,37.08 43.45,37.85 43.45,46.48 39.9,50.04 39.9,53.34 40.15,53.59 40.15,60.2 38.37,61.98 36.09,61.98 33.55,64.52 33.55,68.58 32.28,69.85 J2.11
  Bottom 0.406: TEENS.P17 J2.11
URF-SS
  Top 0.305: URF.4 45.82,15.16 44.21,16.76 44.21,21.08 43.45,21.84 43.45,36.83 42.69,37.59 42.69,46.23 39.13,49.78 39.13,53.85 39.39,54.1 39.39,59.94 38.12,61.21 35.83,61.21 32.78,64.26 32.78,65.02 J2.12
  Bottom 0.406: TEENS.P16 J2.12
VCC_1  (via drill 0.6)
  Top 0.305: v49.04,38.78 48.28,39.54 48.28,73.15 46.5,74.93 38.63,74.93 36.85,76.71 v36.85,92.71
  Top 0.813: U$6.CATH 36.21,39.5 v36.34,39.62
  Bottom 0.305: v49.04,38.78 39.9,38.78 39.43,38.31 | USBDEBUG.2 v36.85,92.71
  Bottom 0.61: C15.1 39.43,38.31 39.64,38.1 39.64,26.76 C1.1 C2.1 45.1,21.72 47.26,19.56 49.5,19.56 SERVO.2 51.46,25.32 RX-TH.2 | C4.1 C3.1 8.27,32.39 7.13,33.53 7.13,35.31 5.35,37.08 4.44,37.08 PCB1.P$2 | C16.1 33.29,36.53 33.29,33.53 32.4,32.63 27.23,32.63 26.59,33.27 18.81,33.27 17.93,32.39 C4.1 | 17.41,32.64 C4.1
  Bottom 0.813: 36.21,38.31 C15.1 | C16.1 36.21,38.31 | 36.21,38.31 36.21,39.5 v36.34,39.62
VCC_1_PREDIODE
  Top 0.813: U$4.VO+ 36.21,27.95 U$6.AN 39.79,33.55 J6.1
  Bottom 0.813: U$4.VO+ U$4.SENSE+
VCC_2  (via drill 0.6)
  Top 0.254: VUSB.A 33.3,92.21 32.28,91.19 32.28,87.88 32.02,87.63
  Top 0.305: 50.18,30.73 50.18,18.96 IMU.2 | v37.36,47.5 37.36,49.38 U$1.VCC
  Top 0.406: IMU.2 URF.2
  Top 0.61: C9.1 33.64,87.56 | C9.1 C10.1 | TEENS.3.3V 26.43,89.16 C6.1 C5.1 24.4,91.29 24.4,92.96 22.88,94.49 9.16,94.49 8.4,93.73 8.4,55.63 | J2.4 32.02,87.63 33.64,87.63 C9.1 | J1.11 8.4,55.63 | I2C.B 52.68,54.53 54.37,52.83 54.37,38.61 53.36,37.59 50.06,37.59 49.55,37.08 49.55,31.37 50.18,30.73 | v22.37,31.75 9.92,31.75 8.4,33.27 8.4,55.63
  Bottom 0.305: TEENS.3.3V J2.4 49.47,87.63 UART.B | I2C.B 51.66,54.1 39.9,54.1 38.63,52.83 38.63,48.77 v37.36,47.5
  Bottom 0.406: J2.4 | J1.11 | C7.1 C8.1 30.5,21.5 | 27.96,22.1 27.96,23.76 U$2.3 27.96,23.84 | URF.2 49.25,12.95 40.66,12.95 39.64,13.97 39.64,17.02 39.13,17.53 36.09,17.53 33.8,19.81 31.01,19.81 30.5,20.32 30.5,21.5 | 27.96,22.1 26.69,20.83 24.4,20.83 22.37,22.86 v22.37,31.75 | 30.5,21.5 28.55,21.5 27.96,22.1
  Bottom 0.61: TEENS.3.3V J2.4 | J1.11 TEENS.3.3V2

### Text on the board
tPlace: GND | GND | 3.3V | R | UART4 | T | 14 | 2 | 7 | PWM | 8 | MOSI | MISO | SPI | SCLK | CS2 | GND | 3.3V | I2C | SDA | SCL | A22 | DAC | A21 | 39 | ADC | 38 | + | + | - | - | + | -
bPlace: Designed by Jay Miley for SSIVD - CPSU ME SP 16-17 | HV+ | HV- | HV+ | HV- | CANH | CANL | GND | CANH | CANL | GND